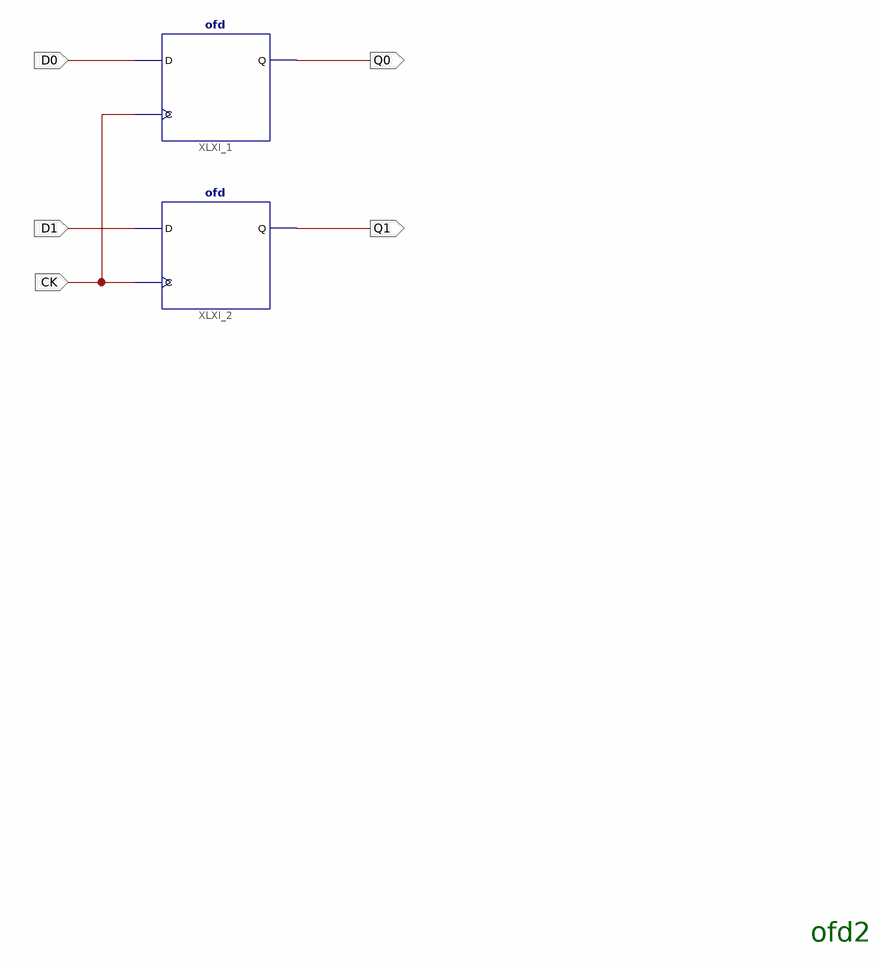
[diagram p0: schematic sheet 1]
// Xilinx ISE schematic ofd2.sch (spartan6) as structural Verilog: 2 symbols, 5 ports
module ofd2 (
  input  D0,
  input  D1,
  input  CK,
  output Q1,
  output Q0
);

  ofd XLXI_1 (.C(CK), .D(D0), .Q(Q0));
  ofd XLXI_2 (.C(CK), .D(D1), .Q(Q1));

  // Notes on the sheet:
  //   ofd2
endmodule
